# EAGLE design BUZZI-05 (EAGLE 4.15)
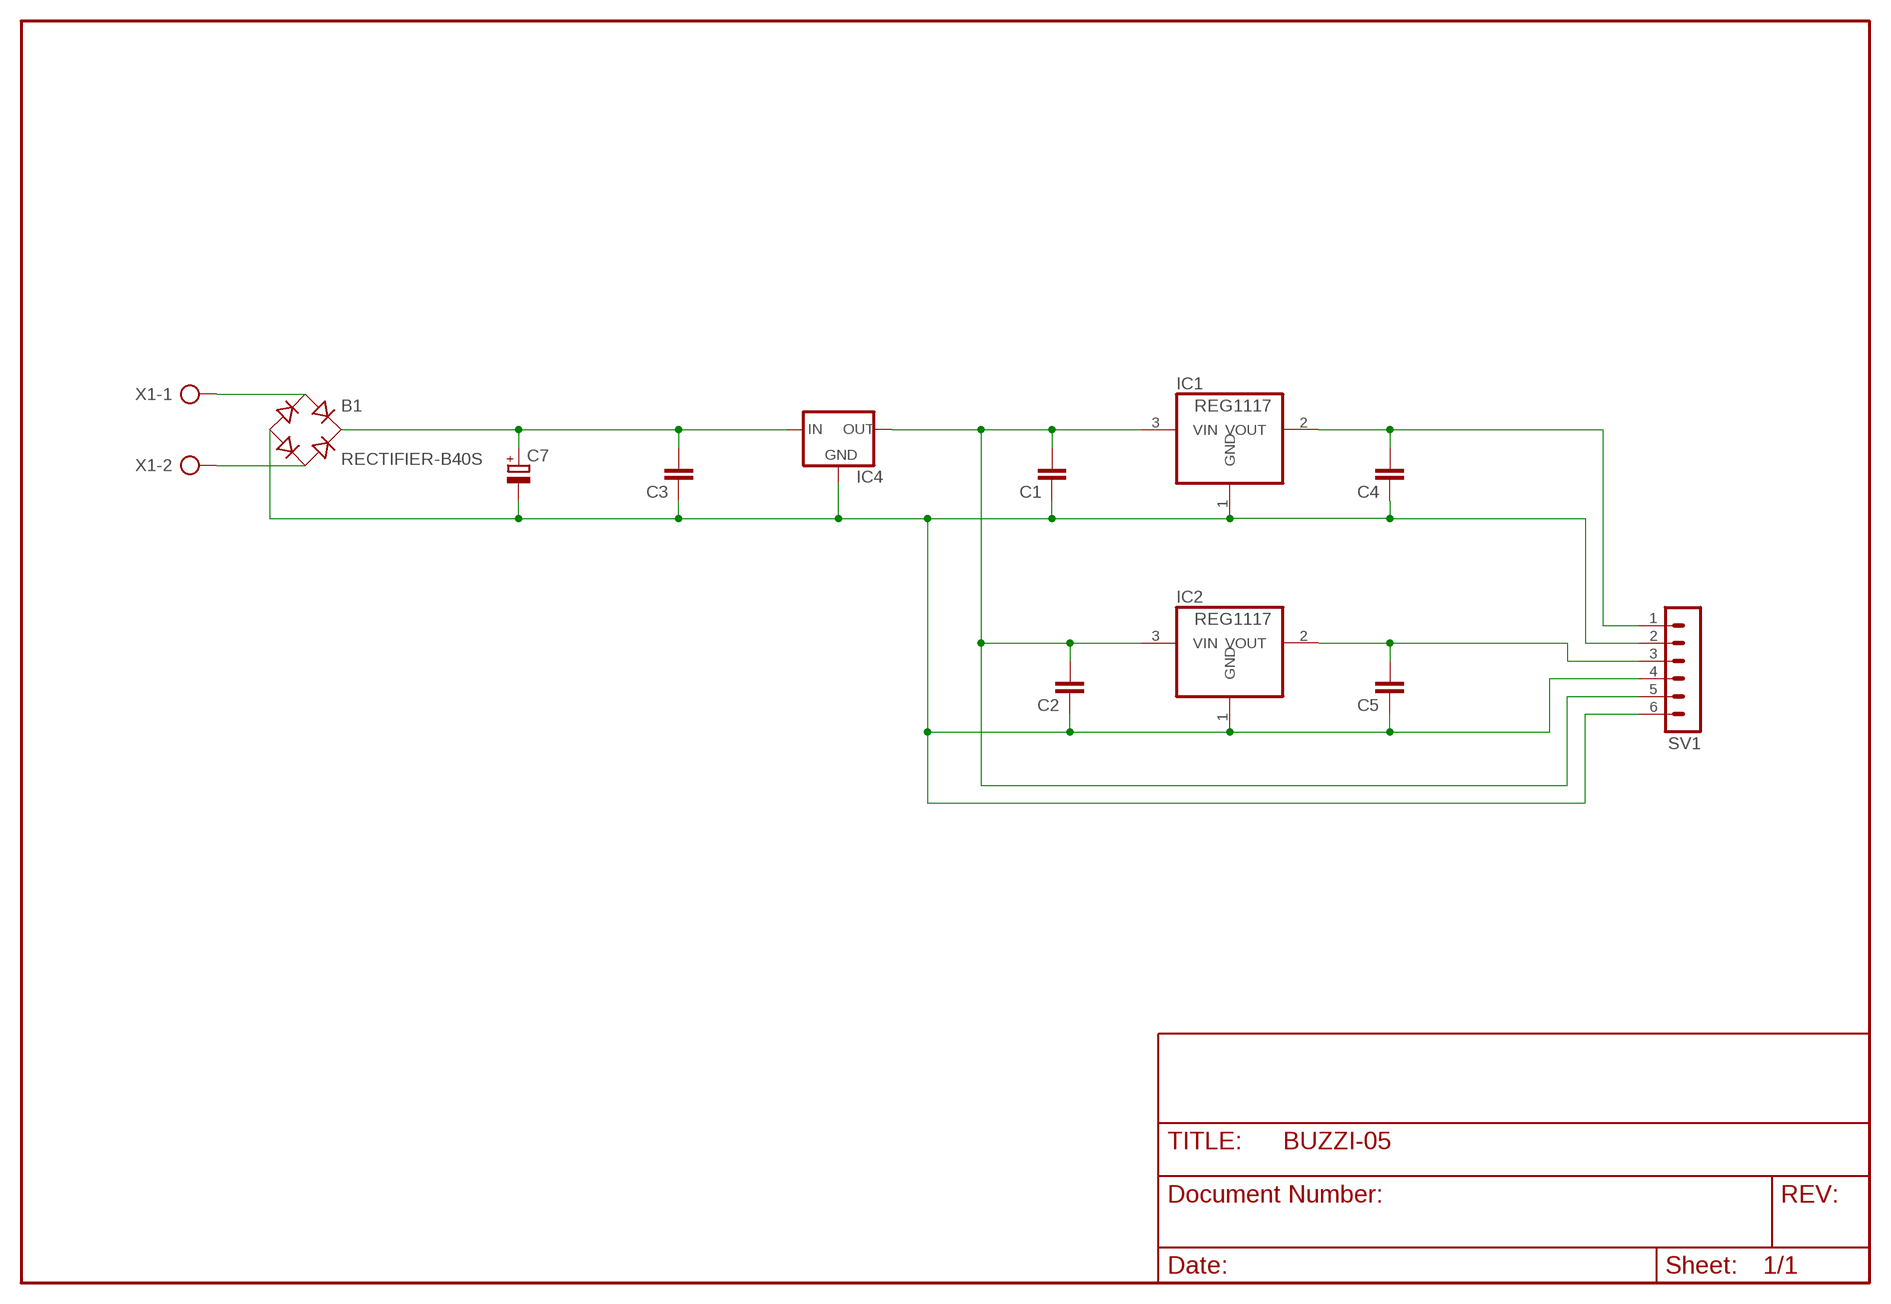
[diagram p0: schematic, sheet 1]

## Parts
B1  RECTIFIER-B40S  [B40S]
C1  C-EUC0805  [C0805]
C2  C-EUC0805  [C0805]
C3  C-EUC0805  [C0805]
C4  C-EUC0805  [C0805]
C5  C-EUC0805  [C0805]
C7  CPOL-EUE5-8.5  [E5-8,5]
IC1  REG1117  [SOT223]
IC2  REG1117  [SOT223]
IC4  78XXS  [78XXS]
SV1  MA06-1  [MA06-1]
X1  AK500/2  [AK500/2]

## Nets
1V8: C4.2 IC1.2(VOUT) SV1.1
3V3: C5.2 IC2.2(VOUT) SV1.3
GND: B1.- C1.1 C2.1 C3.1 C4.1 C5.1 C7.- IC1.1(GND) IC2.1(GND) IC4.GND SV1.2 SV1.4 SV1.6
N$1: B1.AC1 X1.1
N$2: B1.AC2 X1.2
N$3: C1.2 C2.2 IC1.3(VIN) IC2.3(VIN) IC4.OUT SV1.5
VIN: B1.+ C3.2 C7.+ IC4.IN

## Library data of the parts
B1 = rectifier:RECTIFIER-: Rectifier
C1-C5 = rcl:C-EU: CAPACITOR, European symbol
C7 = rcl:CPOL-EU: POLARIZED CAPACITOR, European symbol
IC1 IC2 = burr-brown:REG1117: 800mA and 1A Low Dropout (LDO) Positive Regulator 1.8V, 2.5V, 2.85V, 3.3V, 5V, and Adj
IC4 = v-reg:78XXS: VOLTAGE REGULATOR
SV1 = con-lstb:MA06-1: PIN HEADER
X1 = con-ptr500:AK500/2: CONNECTOR

## Net classes
0 default: width 0.5 mm

## Board
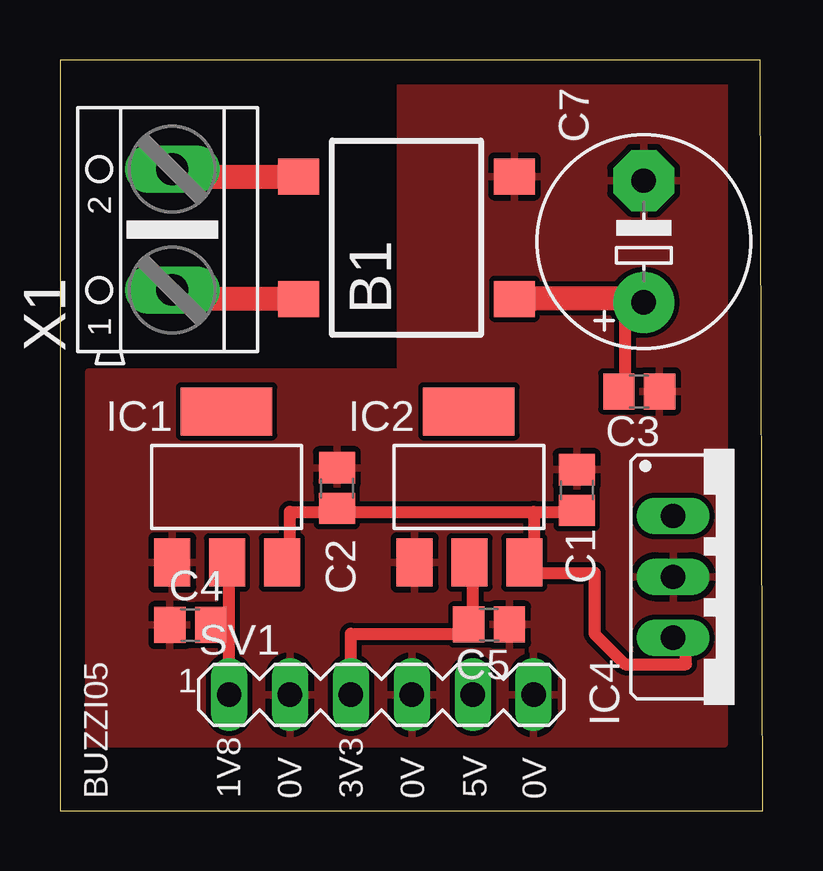
[diagram p1: board, top side]
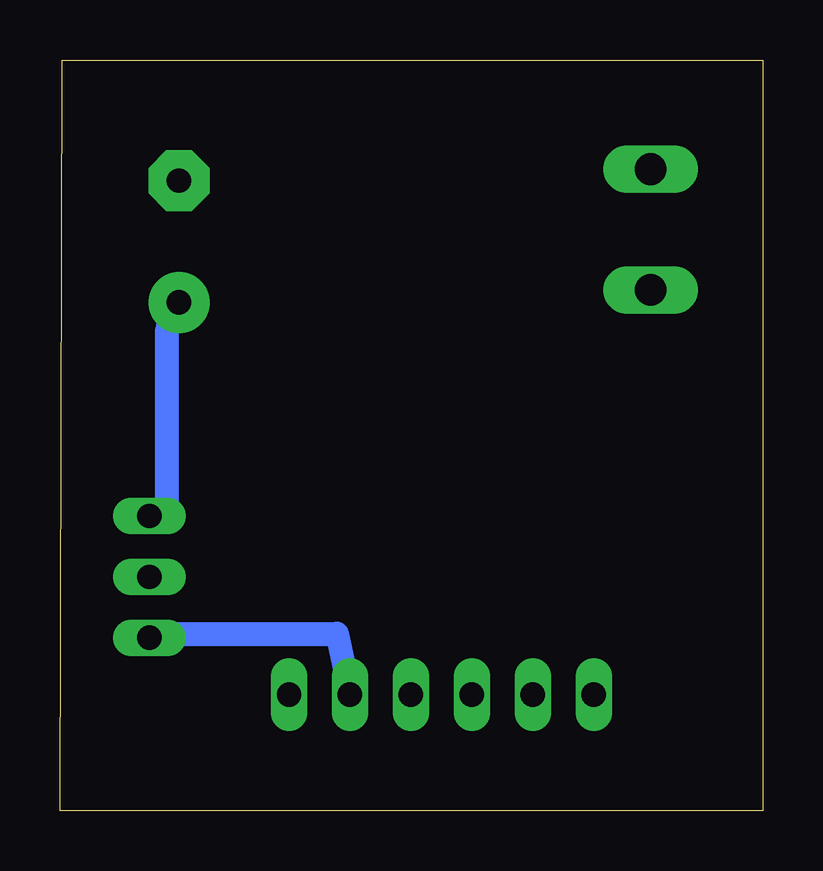
[diagram p2: board, bottom side, seen from below]

Size 29.3 x 31.3 mm. Coordinates in mm from the lower left corner, seen from the top.
Outline: 0,0 29.3,0 29.2,31.3 0,31.3 0,0
Copper layers (1*16): Top 0.035mm / dielectric 1.5mm / Bottom 0.035mm
Design rules "default": minimum track width 10mil, minimum drill 24mil, track to track 8mil, track to pad 8mil, pad to pad 8mil, via to via 8mil, smd to smd 8mil, copper to edge 40mil, drill to drill 8mil, minimum pad ring 10mil, minimum via ring 8mil, stop-mask expansion 4mil, vias tented up to drill 0mil, thermal gap 10mil

### Footprints (pad centres in the part's own frame; a part is rotated, then mirrored left to right if it is on the bottom)
B40S = smd 1.5 x 1.7: + -2.55,-4.5; - 2.55,-4.5; AC1 -2.55,4.5; AC2 2.55,4.5
C0805 = smd 1.3 x 1.5: 1 -0.85,0; 2 0.85,0
E5-8,5 = drill 1.016 pad 2.54 round: + -2.54,0 | drill 1.016 pad 2.54 octagon: - 2.54,0
SOT223 = smd 1.499 x 2.007: 1 -2.261,-3.15; 2 0.025,-3.15; 3 2.311,-3.15 | smd 3.81 x 2.007: 4 0,3.15
78XXS = drill 1.016 long: GND 0,-2.54; IN -2.54,-2.54; OUT 2.54,-2.54
MA06-1 = drill 1.016 long: 1 -6.35,0; 2 -3.81,0; 3 -1.27,0; 4 1.27,0; 5 3.81,0; 6 6.35,0
AK500/2 = drill 1.321 long: 1 -2.515,0; 2 2.515,0

### Placement (x,y rotation side)
B1  14.45,23.89 90 top
C1  21.55,13.37 270 top
C2  11.55,13.45 270 top
C3  24.15,17.48 180 top
C4  5.43,7.74 0 top
C5  17.89,7.76 180 top
C7  24.34,23.73 90 top
IC1  6.94,13.5 0 top
IC2  17.05,13.5 0 top
IC4  28.11,9.75 270 top
SV1  13.4,4.84 0 top
X1  4.68,24.23 90 top

### Tracks (layer width: path | path; a pad name or v marks a point on that pad's centre or on a via)
1V8
  Top 0.5: 7.05,7.38 7.05,9.92 IC1.2 | 7.05,7.38 C4.2 | SV1.1 7.05,7.38
3V3
  Top 0.5: 17.21,7.38 17.21,9.92 IC2.2 | 17.21,7.38 12.13,7.38 SV1.3 | 17.21,7.38 C5.2
GND
  pour Top: 1.2,18.3 14.2,18.3 14.2,30.3 27.7,30.3 27.7,2.8 1.2,2.8
N$1
  Top 0.5: 9.59,21.35 B1.AC1
  Top 1: 9.59,21.35 5.78,21.35 X1.1
N$2
  Top 0.5: 9.59,26.43 B1.AC2
  Top 1: 9.59,26.43 5.78,26.43 X1.2
N$3
  Top 0.5: 19.75,12.46 21.02,12.46 C1.2 | 19.75,12.46 19.75,11.19 IC2.3 19.75,9.92 22.29,9.92 22.29,7.38 23.56,6.11 26.1,6.11 26.1,7.38 IC4.OUT | IC1.3 9.59,11.19 9.59,12.46 10.86,12.46 C2.2 12.13,12.46 19.75,12.46
  Bottom 1: SV1.5 17.75,7.38 24.83,7.38 IC4.OUT
VIN
  Top 0.5: C3.2 23.56,17.54 23.56,21.35 C7.+ | 19.75,21.35 B1.+
  Top 1: 23.56,21.35 19.75,21.35
  Bottom 1: IC4.IN 24.83,12.46 24.83,20.08 C7.+

### Text on the board
tPlace: BUZZI05 | 1V8 | 0V | 3V3 | 0V | 5V | 0V